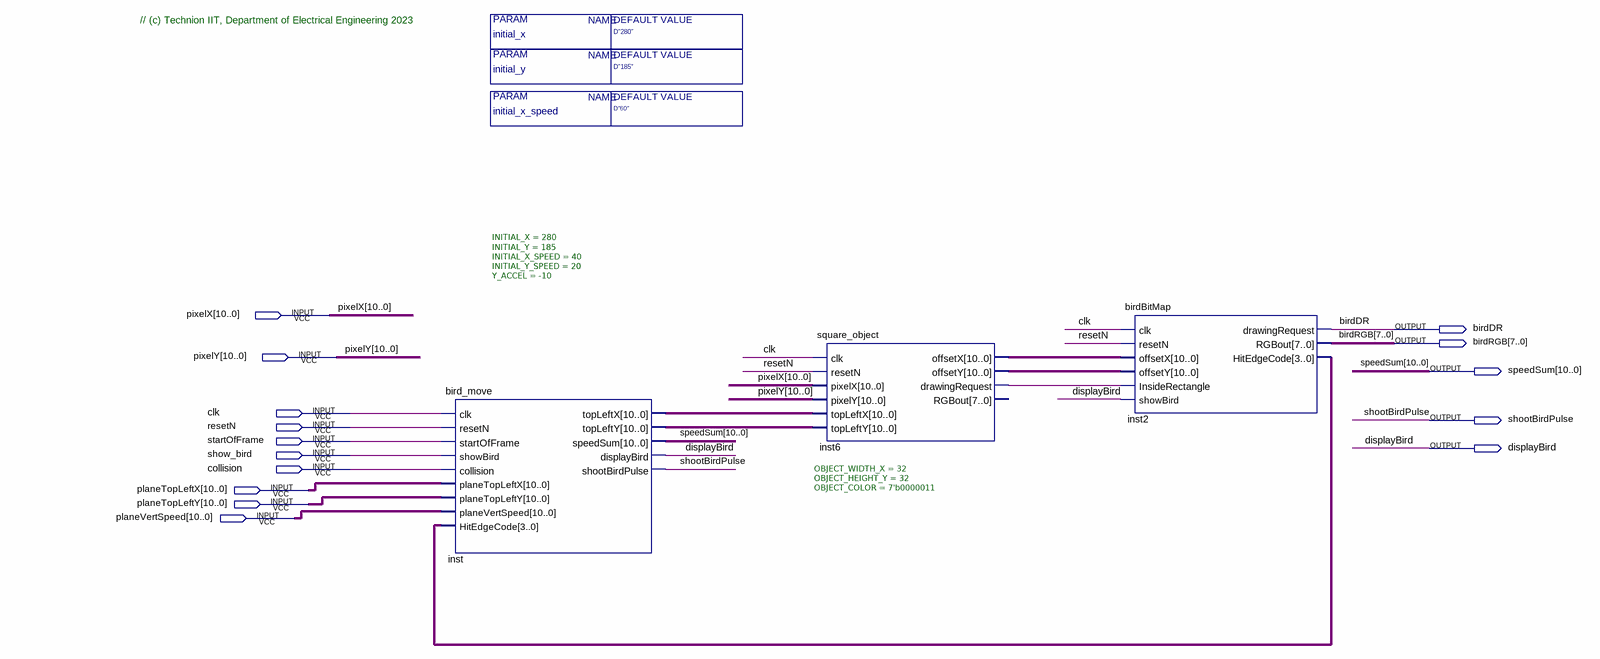
[diagram p0: schematic sheet]
// Quartus schematic Bird_Block_T.bdf as structural Verilog: 3 symbols, 15 pins
module Bird_Block_T #(parameter initial_x = "D\"280\"", parameter initial_y = "D\"185\"", parameter initial_x_speed = "D\"60\"") (
  input  [10:0] pixelX,
  input  [10:0] pixelY,
  input  clk,
  input  resetN,
  input  startOfFrame,
  input  show_bird,
  input  collision,
  input  [10:0] planeTopLeftX,
  input  [10:0] planeTopLeftY,
  input  [10:0] planeVertSpeed,
  output birdDR,
  output [7:0] birdRGB,
  output [10:0] speedSum,
  output shootBirdPulse,
  output displayBird
);

  wire inst6_drawingrequest;
  wire [3:0] inst2_hitedgecode;
  wire [10:0] inst6_offsetx, inst6_offsety, inst_topleftx, inst_toplefty;

  bird_move #(.INITIAL_X(280), .INITIAL_Y(185), .INITIAL_X_SPEED(40), .INITIAL_Y_SPEED(20), .Y_ACCEL(-10)) inst (
    .clk(clk), .resetN(resetN), .startOfFrame(startOfFrame), .showBird(show_bird), .collision(collision),
    .planeTopLeftX(planeTopLeftX), .planeTopLeftY(planeTopLeftY), .planeVertSpeed(planeVertSpeed),
    .HitEdgeCode(inst2_hitedgecode), .topLeftX(inst_topleftx), .topLeftY(inst_toplefty), .speedSum(speedSum),
    .displayBird(displayBird), .shootBirdPulse(shootBirdPulse));
  square_object #(.OBJECT_WIDTH_X(32), .OBJECT_HEIGHT_Y(32), .OBJECT_COLOR(7'b0000011)) inst6 (
    .clk(clk), .resetN(resetN), .pixelX(pixelX), .pixelY(pixelY), .topLeftX(inst_topleftx),
    .topLeftY(inst_toplefty), .offsetX(inst6_offsetx), .offsetY(inst6_offsety),
    .drawingRequest(inst6_drawingrequest));  // open: RGBout
  birdBitMap inst2 (
    .clk(clk), .resetN(resetN), .offsetX(inst6_offsetx), .offsetY(inst6_offsety),
    .InsideRectangle(inst6_drawingrequest), .showBird(displayBird), .drawingRequest(birdDR),
    .RGBout(birdRGB), .HitEdgeCode(inst2_hitedgecode));

  // Notes on the sheet:
  //   // (c) Technion IIT, Department of Electrical Engineering 2023
endmodule
